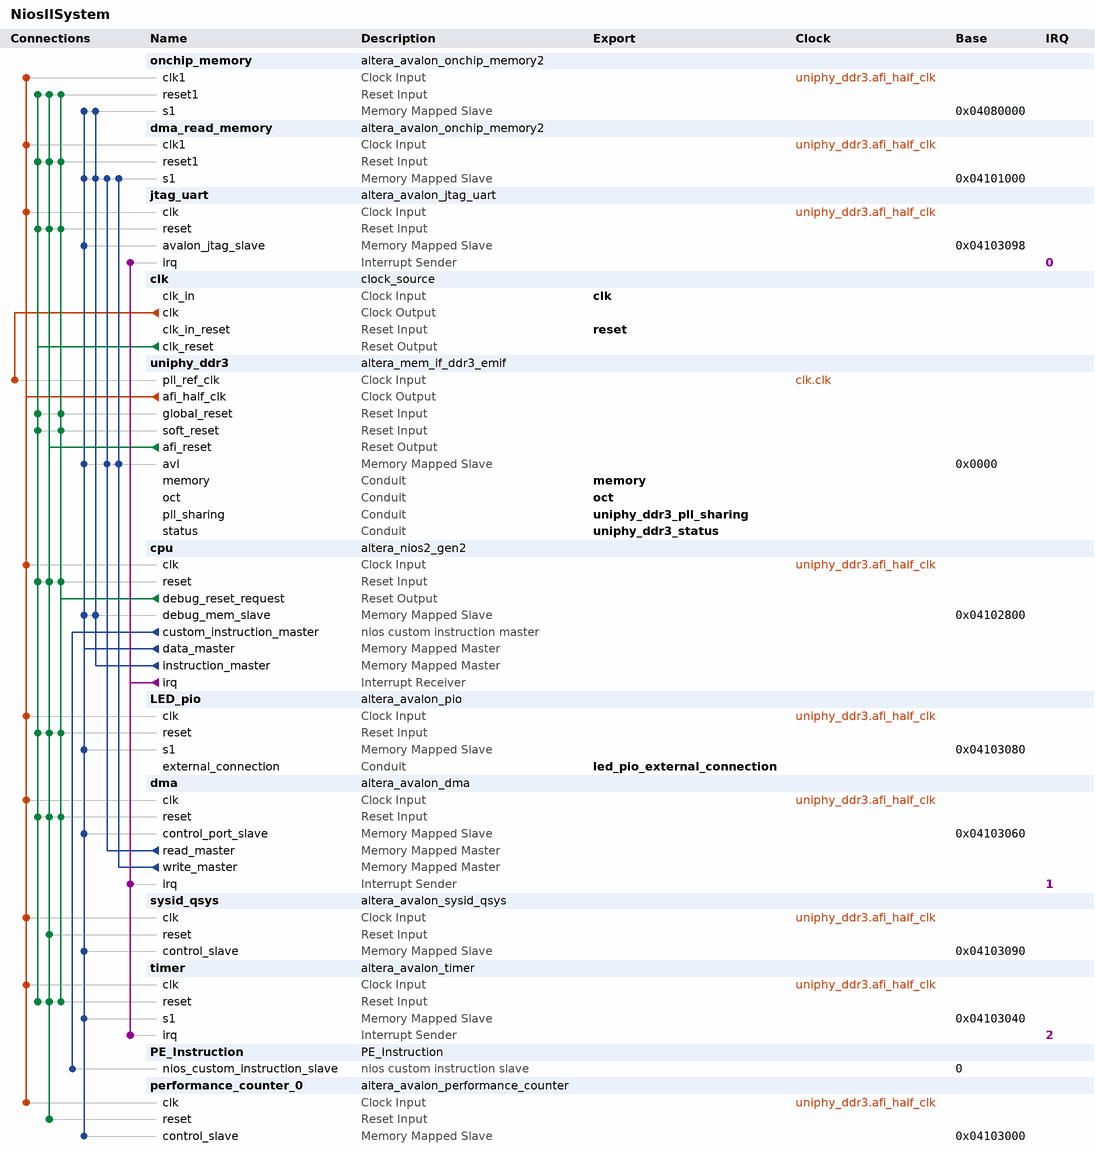
[diagram p0: system contents]
# Platform Designer (Qsys) system NiosIISystem, Cyclone V 5CGTFD9E5F35C7
# Parameters at their usual value, and those the tool derives, are not listed.
package require -exact qsys 18.0
create_system NiosIISystem
set_project_property DEVICE_FAMILY {Cyclone V}
set_project_property DEVICE 5CGTFD9E5F35C7

add_instance onchip_memory altera_avalon_onchip_memory2 18.0
set_instance_parameter_value onchip_memory dataWidth 32
set_instance_parameter_value onchip_memory dualPort false
set_instance_parameter_value onchip_memory initMemContent true
set_instance_parameter_value onchip_memory initializationFileName onchip_mem.hex
set_instance_parameter_value onchip_memory memorySize 524288

add_instance dma_read_memory altera_avalon_onchip_memory2 18.0
set_instance_parameter_value dma_read_memory dataWidth 32
set_instance_parameter_value dma_read_memory dualPort false
set_instance_parameter_value dma_read_memory initMemContent true
set_instance_parameter_value dma_read_memory initializationFileName onchip_mem.hex
set_instance_parameter_value dma_read_memory memorySize 4096

add_instance jtag_uart altera_avalon_jtag_uart 18.0
set_instance_parameter_value jtag_uart simInteractiveOptions NO_INTERACTIVE_WINDOWS

add_instance clk clock_source 18.0
set_instance_parameter_value clk clockFrequency 100000000

add_instance uniphy_ddr3 altera_mem_if_ddr3_emif 18.0
set_instance_parameter_value uniphy_ddr3 AVL_MAX_SIZE 16
set_instance_parameter_value uniphy_ddr3 BYTE_ENABLE false
set_instance_parameter_value uniphy_ddr3 CALIBRATION_MODE Skip
set_instance_parameter_value uniphy_ddr3 CPORT_TYPE_PORT Bidirectional,Bidirectional,Bidirectional,Bidirectional,Bidirectional,Bidirectional
set_instance_parameter_value uniphy_ddr3 EXPORT_AFI_HALF_CLK true
set_instance_parameter_value uniphy_ddr3 HARD_EMIF false
set_instance_parameter_value uniphy_ddr3 MEM_BANKADDR_WIDTH 3
set_instance_parameter_value uniphy_ddr3 MEM_CLK_FREQ 300.0
set_instance_parameter_value uniphy_ddr3 MEM_CLK_FREQ_MAX 666.667
set_instance_parameter_value uniphy_ddr3 MEM_COL_ADDR_WIDTH 10
set_instance_parameter_value uniphy_ddr3 MEM_DQ_WIDTH 8
set_instance_parameter_value uniphy_ddr3 MEM_FORMAT DISCRETE
set_instance_parameter_value uniphy_ddr3 MEM_ROW_ADDR_WIDTH 13
set_instance_parameter_value uniphy_ddr3 MEM_RTT_NOM RZQ/4
set_instance_parameter_value uniphy_ddr3 MEM_TCL 8
set_instance_parameter_value uniphy_ddr3 MEM_TFAW_NS 45.0
set_instance_parameter_value uniphy_ddr3 MEM_TRAS_NS 36.0
set_instance_parameter_value uniphy_ddr3 MEM_TRCD_NS 13.5
set_instance_parameter_value uniphy_ddr3 MEM_TRFC_NS 110.0
set_instance_parameter_value uniphy_ddr3 MEM_TRP_NS 13.5
set_instance_parameter_value uniphy_ddr3 MEM_TRRD_NS 7.5
set_instance_parameter_value uniphy_ddr3 MEM_TRTP_NS 7.5
set_instance_parameter_value uniphy_ddr3 MEM_TWTR 5
set_instance_parameter_value uniphy_ddr3 MEM_VENDOR Micron
set_instance_parameter_value uniphy_ddr3 MEM_WTCL 6
set_instance_parameter_value uniphy_ddr3 PLL_LOCATION Top_Bottom
set_instance_parameter_value uniphy_ddr3 POWER_OF_TWO_BUS true
set_instance_parameter_value uniphy_ddr3 PRIORITY_PORT 1,1,1,1,1,1
set_instance_parameter_value uniphy_ddr3 RATE Half
set_instance_parameter_value uniphy_ddr3 REF_CLK_FREQ 100.0
set_instance_parameter_value uniphy_ddr3 SPEED_GRADE 7
set_instance_parameter_value uniphy_ddr3 TIMING_BOARD_AC_SKEW 0.02
set_instance_parameter_value uniphy_ddr3 TIMING_BOARD_AC_TO_CK_SKEW 0.0
set_instance_parameter_value uniphy_ddr3 TIMING_BOARD_DQ_TO_DQS_SKEW 0.0
set_instance_parameter_value uniphy_ddr3 TIMING_BOARD_MAX_CK_DELAY 0.6
set_instance_parameter_value uniphy_ddr3 TIMING_BOARD_MAX_DQS_DELAY 0.6
set_instance_parameter_value uniphy_ddr3 TIMING_BOARD_SKEW_BETWEEN_DQS 0.02
set_instance_parameter_value uniphy_ddr3 TIMING_BOARD_SKEW_CKDQS_DIMM_MAX 0.01
set_instance_parameter_value uniphy_ddr3 TIMING_BOARD_SKEW_CKDQS_DIMM_MIN -0.01
set_instance_parameter_value uniphy_ddr3 TIMING_BOARD_SKEW_WITHIN_DQS 0.02
set_instance_parameter_value uniphy_ddr3 TIMING_TDH 65
set_instance_parameter_value uniphy_ddr3 TIMING_TDQSCK 255
set_instance_parameter_value uniphy_ddr3 TIMING_TDQSQ 125
set_instance_parameter_value uniphy_ddr3 TIMING_TDQSS 0.25
set_instance_parameter_value uniphy_ddr3 TIMING_TDS 30
set_instance_parameter_value uniphy_ddr3 TIMING_TDSH 0.2
set_instance_parameter_value uniphy_ddr3 TIMING_TDSS 0.2
set_instance_parameter_value uniphy_ddr3 TIMING_TIH 140
set_instance_parameter_value uniphy_ddr3 TIMING_TIS 190
set_instance_parameter_value uniphy_ddr3 TIMING_TQSH 0.4
set_instance_parameter_value uniphy_ddr3 USER_DEBUG_LEVEL 1

add_instance cpu altera_nios2_gen2 18.0
set_instance_parameter_value cpu dcache_size 2048
set_instance_parameter_value cpu exceptionOffset 64
set_instance_parameter_value cpu exceptionSlave onchip_memory.s1
set_instance_parameter_value cpu icache_size 4096
set_instance_parameter_value cpu impl Fast
set_instance_parameter_value cpu resetOffset 32
set_instance_parameter_value cpu resetSlave onchip_memory.s1

add_instance LED_pio altera_avalon_pio 18.0
set_instance_parameter_value LED_pio direction Output
set_instance_parameter_value LED_pio width 8

add_instance dma altera_avalon_dma 18.0
set_instance_parameter_value dma allowByteTransactions false
set_instance_parameter_value dma allowDoubleWordTransactions false
set_instance_parameter_value dma allowHalfWordTransactions false
set_instance_parameter_value dma allowQuadWordTransactions false
set_instance_parameter_value dma burstEnable false
set_instance_parameter_value dma fifoDepth 32
set_instance_parameter_value dma maxBurstSize 128
set_instance_parameter_value dma minimumDmaTransactionRegisterWidth 13

add_instance sysid_qsys altera_avalon_sysid_qsys 18.0
set_instance_parameter_value sysid_qsys id 0

add_instance timer altera_avalon_timer 18.0
set_instance_parameter_value timer period 1
set_instance_parameter_value timer periodUnits MSEC

add_instance PE_Instruction PE_Instruction 1.0

add_instance performance_counter_0 altera_avalon_performance_counter 18.0
set_instance_parameter_value performance_counter_0 numberOfSections 3

# connections
add_connection clk.clk uniphy_ddr3.pll_ref_clk clock
add_connection uniphy_ddr3.afi_half_clk cpu.clk clock
add_connection uniphy_ddr3.afi_half_clk dma.clk clock
add_connection uniphy_ddr3.afi_half_clk dma_read_memory.clk1 clock
add_connection uniphy_ddr3.afi_half_clk jtag_uart.clk clock
add_connection uniphy_ddr3.afi_half_clk LED_pio.clk clock
add_connection uniphy_ddr3.afi_half_clk onchip_memory.clk1 clock
add_connection uniphy_ddr3.afi_half_clk performance_counter_0.clk clock
add_connection uniphy_ddr3.afi_half_clk sysid_qsys.clk clock
add_connection uniphy_ddr3.afi_half_clk timer.clk clock
add_connection clk.clk_reset cpu.reset reset
add_connection clk.clk_reset dma.reset reset
add_connection clk.clk_reset dma_read_memory.reset1 reset
add_connection clk.clk_reset jtag_uart.reset reset
add_connection clk.clk_reset LED_pio.reset reset
add_connection clk.clk_reset onchip_memory.reset1 reset
add_connection clk.clk_reset timer.reset reset
add_connection clk.clk_reset uniphy_ddr3.global_reset reset
add_connection clk.clk_reset uniphy_ddr3.soft_reset reset
add_connection cpu.debug_reset_request cpu.reset reset
add_connection cpu.debug_reset_request dma.reset reset
add_connection cpu.debug_reset_request dma_read_memory.reset1 reset
add_connection cpu.debug_reset_request jtag_uart.reset reset
add_connection cpu.debug_reset_request LED_pio.reset reset
add_connection cpu.debug_reset_request onchip_memory.reset1 reset
add_connection cpu.debug_reset_request timer.reset reset
add_connection cpu.debug_reset_request uniphy_ddr3.global_reset reset
add_connection cpu.debug_reset_request uniphy_ddr3.soft_reset reset
add_connection uniphy_ddr3.afi_reset cpu.reset reset
add_connection uniphy_ddr3.afi_reset dma.reset reset
add_connection uniphy_ddr3.afi_reset dma_read_memory.reset1 reset
add_connection uniphy_ddr3.afi_reset jtag_uart.reset reset
add_connection uniphy_ddr3.afi_reset LED_pio.reset reset
add_connection uniphy_ddr3.afi_reset onchip_memory.reset1 reset
add_connection uniphy_ddr3.afi_reset performance_counter_0.reset reset
add_connection uniphy_ddr3.afi_reset sysid_qsys.reset reset
add_connection uniphy_ddr3.afi_reset timer.reset reset
add_connection cpu.data_master cpu.debug_mem_slave avalon
set_connection_parameter_value cpu.data_master/cpu.debug_mem_slave baseAddress 0x04102800
add_connection cpu.data_master dma.control_port_slave avalon
set_connection_parameter_value cpu.data_master/dma.control_port_slave baseAddress 0x04103060
add_connection cpu.data_master dma_read_memory.s1 avalon
set_connection_parameter_value cpu.data_master/dma_read_memory.s1 baseAddress 0x04101000
add_connection cpu.data_master jtag_uart.avalon_jtag_slave avalon
set_connection_parameter_value cpu.data_master/jtag_uart.avalon_jtag_slave baseAddress 0x04103098
add_connection cpu.data_master LED_pio.s1 avalon
set_connection_parameter_value cpu.data_master/LED_pio.s1 baseAddress 0x04103080
add_connection cpu.data_master onchip_memory.s1 avalon
set_connection_parameter_value cpu.data_master/onchip_memory.s1 baseAddress 0x04080000
add_connection cpu.data_master performance_counter_0.control_slave avalon
set_connection_parameter_value cpu.data_master/performance_counter_0.control_slave baseAddress 0x04103000
add_connection cpu.data_master sysid_qsys.control_slave avalon
set_connection_parameter_value cpu.data_master/sysid_qsys.control_slave baseAddress 0x04103090
add_connection cpu.data_master timer.s1 avalon
set_connection_parameter_value cpu.data_master/timer.s1 baseAddress 0x04103040
add_connection cpu.data_master uniphy_ddr3.avl avalon
set_connection_parameter_value cpu.data_master/uniphy_ddr3.avl baseAddress 0x0000
add_connection cpu.instruction_master cpu.debug_mem_slave avalon
set_connection_parameter_value cpu.instruction_master/cpu.debug_mem_slave baseAddress 0x04102800
add_connection cpu.instruction_master dma_read_memory.s1 avalon
set_connection_parameter_value cpu.instruction_master/dma_read_memory.s1 baseAddress 0x04101000
add_connection cpu.instruction_master onchip_memory.s1 avalon
set_connection_parameter_value cpu.instruction_master/onchip_memory.s1 baseAddress 0x04080000
add_connection dma.read_master dma_read_memory.s1 avalon
set_connection_parameter_value dma.read_master/dma_read_memory.s1 baseAddress 0x04101000
add_connection dma.read_master uniphy_ddr3.avl avalon
set_connection_parameter_value dma.read_master/uniphy_ddr3.avl baseAddress 0x0000
add_connection dma.write_master dma_read_memory.s1 avalon
set_connection_parameter_value dma.write_master/dma_read_memory.s1 baseAddress 0x04101000
add_connection dma.write_master uniphy_ddr3.avl avalon
set_connection_parameter_value dma.write_master/uniphy_ddr3.avl baseAddress 0x0000
add_connection cpu.irq dma.irq interrupt
set_connection_parameter_value cpu.irq/dma.irq irqNumber 1
add_connection cpu.irq jtag_uart.irq interrupt
set_connection_parameter_value cpu.irq/jtag_uart.irq irqNumber 0
add_connection cpu.irq timer.irq interrupt
set_connection_parameter_value cpu.irq/timer.irq irqNumber 2
add_connection cpu.custom_instruction_master PE_Instruction.nios_custom_instruction_slave nios_custom_instruction
set_connection_parameter_value cpu.custom_instruction_master/PE_Instruction.nios_custom_instruction_slave CIName pe_instruction_0
set_connection_parameter_value cpu.custom_instruction_master/PE_Instruction.nios_custom_instruction_slave baseAddress 0

# exported interfaces
add_interface clk clock sink
set_interface_property clk EXPORT_OF clk.clk_in
add_interface led_pio_external_connection conduit end
set_interface_property led_pio_external_connection EXPORT_OF LED_pio.external_connection
add_interface memory conduit end
set_interface_property memory EXPORT_OF uniphy_ddr3.memory
add_interface oct conduit end
set_interface_property oct EXPORT_OF uniphy_ddr3.oct
add_interface reset reset sink
set_interface_property reset EXPORT_OF clk.clk_in_reset
add_interface uniphy_ddr3_pll_sharing conduit end
set_interface_property uniphy_ddr3_pll_sharing EXPORT_OF uniphy_ddr3.pll_sharing
add_interface uniphy_ddr3_status conduit end
set_interface_property uniphy_ddr3_status EXPORT_OF uniphy_ddr3.status

set_interconnect_requirement {$system} qsys_mm.clockCrossingAdapter AUTO
set_interconnect_requirement {$system} qsys_mm.enableEccProtection FALSE
set_interconnect_requirement {$system} qsys_mm.insertDefaultSlave FALSE
set_interconnect_requirement {$system} qsys_mm.maxAdditionalLatency 1

save_system NiosIISystem.qsys
